# Altium schematic sheet TempMeasure.SchDoc
size A4; SheetNumber: 1; SheetTotal: 1
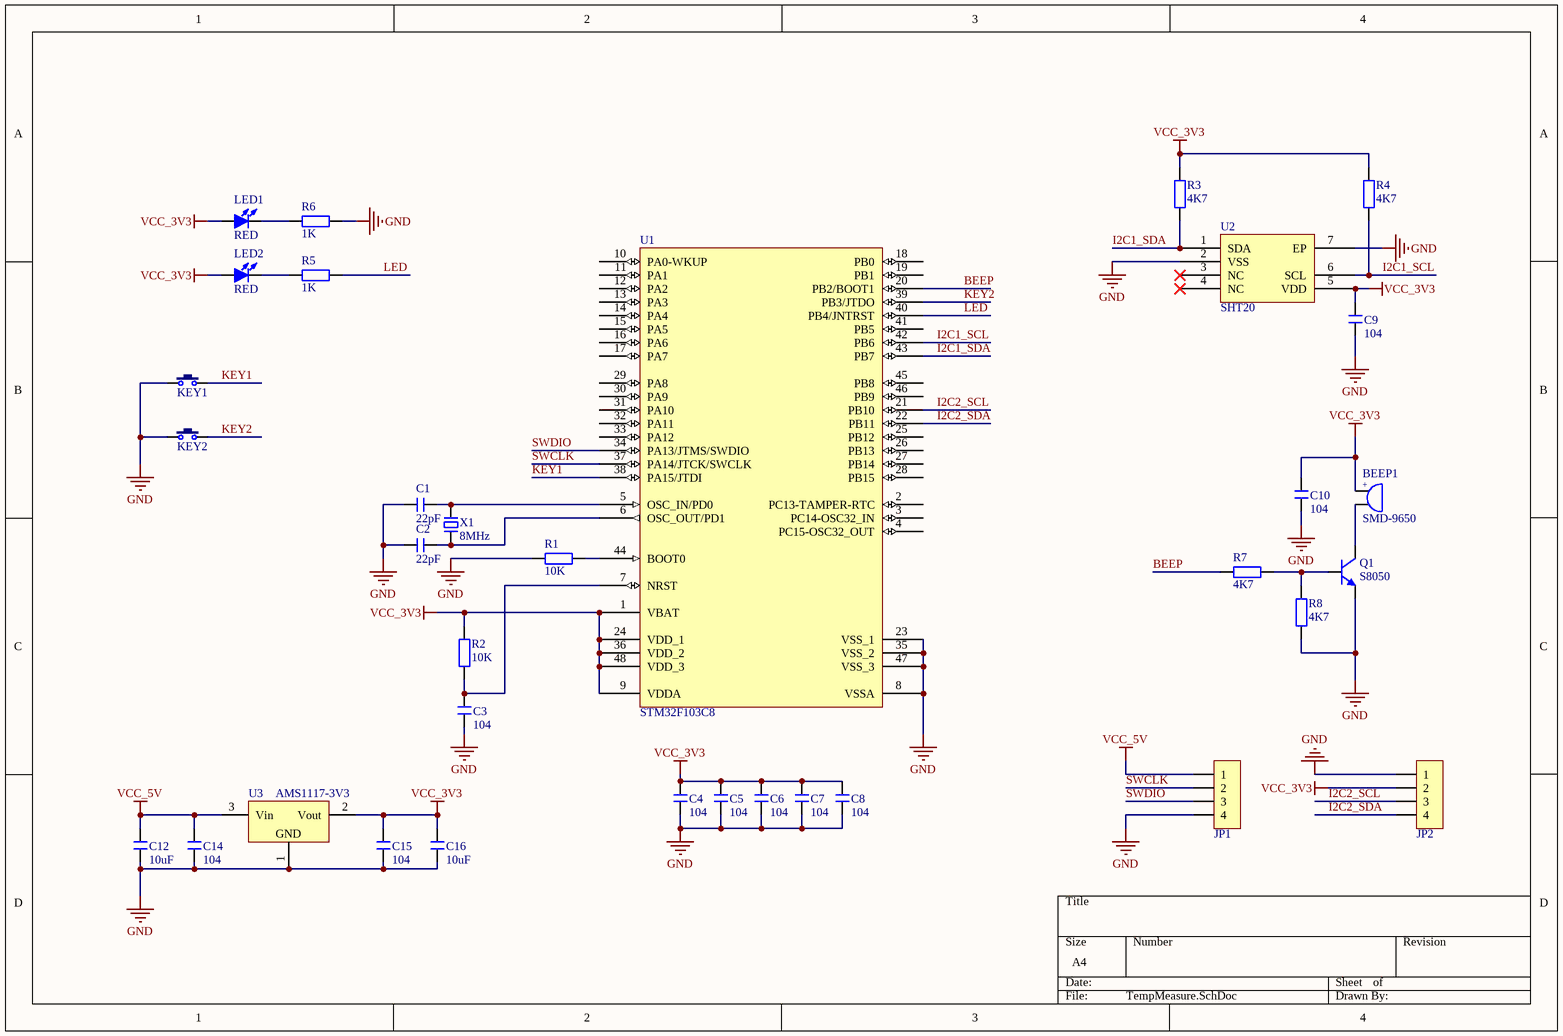
[diagram p0: TempMeasure.SchDoc]

## Parts
BEEP1  SMD-9650  [BUZ-SMD-9650]
C1  22pF  [C 0805]
C2  22pF  [C 0805]
C3  104  [C 0805]
C4  104  [C 0805]
C5  104  [C 0805]
C6  104  [C 0805]
C7  104  [C 0805]
C8  104  [C 0805]
C9  104  [C 0805]
C10  104  [C 0805]
C12  10uF  [C 0805]
C14  104  [C 0805]
C15  104  [C 0805]
C16  10uF  [C 0805]
JP1  HDR-1X4  [XH2.54-LI-4P]  (value not drawn)
JP2  HDR-1X4  [HDR2.54-M-LI-4P]  (value not drawn)
KEY1  KEY  [ButtonTACT_3x4x2_180]  (value not drawn)
KEY2  KEY  [ButtonTACT_3x4x2_180]  (value not drawn)
LED1  RED  [LED 0805R]
LED2  RED  [LED 0805G]
Q1  S8050  [SOT23-3N]
R1  10K  [R 0805]
R2  10K  [R 0805]
R3  4K7  [R 0805]
R4  4K7  [R 0805]
R5  1K  [R 0805]
R6  1K  [R 0805]
R7  4K7  [R 0805]
R8  4K7  [R 0805]
U1  STM32F103C8  [LQFP48 7X7_N]
U2  SHT20  [DFN-6]
U3  AMS1117-3V3  [SOT223_L]
X1  8MHz  [XTAL-49S SMD]

## Nets
GND: C1.1 C2.1 C3.1 C4.1 C5.1 C6.1 C7.1 C8.1 C9.1 C10.1 C12.1 C14.2 C15.1 C16.1 JP1.4 JP2.1 KEY1.1 KEY2.1 Q1.2(E) R1.1 R6.2 R8.1 U1.8(VSSA) U1.23(VSS_1) U1.35(VSS_2) U1.47(VSS_3) U2.2(VSS) U2.7(EP) U3.1(GND)
VCC_3V3: BEEP1.1 C4.2 C5.2 C6.2 C7.2 C8.2 C9.2 C10.2 C15.2 C16.2 JP2.2 LED1.1(A) LED2.1(A) R2.2 R3.2 R4.2 U1.1(VBAT) U1.9(VDDA) U1.24(VDD_1) U1.36(VDD_2) U1.48(VDD_3) U2.5(VDD) U3.2(Vout)
VCC_5V: C12.2 C14.1 JP1.1 U3.3(Vin)
BEEP: R7.1 U1.20(PB2/BOOT1)
I2C1_SCL: R4.1 U1.42(PB6) U2.6(SCL)
I2C1_SDA: R3.1 U1.43(PB7) U2.1(SDA)
I2C2_SCL: JP2.3 U1.21(PB10)
I2C2_SDA: JP2.4 U1.22(PB11)
KEY1: KEY1.2 U1.38(PA15/JTDI)
KEY2: KEY2.2 U1.39(PB3/JTDO)
LED: R5.2 U1.40(PB4/JNTRST)
SWCLK: JP1.2 U1.37(PA14/JTCK/SWCLK)
SWDIO: JP1.3 U1.34(PA13/JTMS/SWDIO)
NetBEEP1_2: BEEP1.2 Q1.3(C)
NetC1_2: C1.2 U1.5(OSC_IN/PD0) X1.2
NetC2_2: C2.2 U1.6(OSC_OUT/PD1) X1.1
NetC3_2: C3.2 R2.1 U1.7(NRST)
NetLED1_2: LED1.2(K) R6.1
NetLED2_2: LED2.2(K) R5.1
NetQ1_1: Q1.1(B) R7.2 R8.2
NetR1_2: R1.2 U1.44(BOOT0)

Not connected (* = marked no-connect by the designer): U1 2(PC13-TAMPER-RTC) 3(PC14-OSC32_IN) 4(PC15-OSC32_OUT) 10(PA0-WKUP) 11(PA1) 12(PA2) 13(PA3) 14(PA4) 15(PA5) 16(PA6) 17(PA7) 18(PB0) 19(PB1) 25(PB12) 26(PB13) 27(PB14) 28(PB15) 29(PA8) 30(PA9) 31(PA10) 32(PA11) 33(PA12) 41(PB5) 45(PB8) 46(PB9); U2 3(NC)* 4(NC)*

## Notes on the sheet
- (in symbol BEEP) +

## Library data of the parts
BEEP1 = BEEP: 蜂鸣器; 版权归属: 源创客; BOM名称: 蜂鸣器; 学习资源: www.ooocke.com
C1-C10 C12 C14-C16 = C: 无极性贴片电容; 版权归属: 源创客; BOM名称: 无极性贴片电容; 学习资源: www.ooocke.com
JP1 JP2 = Header 4: 4P接插件; 版权归属: 源创客; BOM名称: 4P接插件; 学习资源: www.ooocke.com
KEY1 KEY2 = KEY: 按键; BOM名称: 3x6轻触开关; 版权归属: 源创客; 学习资源: www.ooocke.com
LED1 LED2 = LED-SMD: 贴片LED; 版权归属: 源创客; BOM名称: 贴片LED; 学习资源: www.ooocke.com
Q1 = 8050-SMD: 高频放大-NPN型; 版权归属: 源创客; 属性: 40V 1.5A 1W 100MHZ; BOM名称: 高频放大-NPN型; 学习资源: www.ooocke.com
R1-R8 = R: 贴片电阻; 版权归属: 源创客; BOM名称: 贴片电阻; 学习资源: www.ooocke.com
U1 = STM32F103C8: Flaah:64/RAM:20/IO:36; BOM名称: 32位STM单片机; 版权归属: 源创客; 学习资源: www.ooocke.com
U3 = AMS1117: 三端稳压芯片; BOM名称: 稳压芯片; 版权归属: 源创客; 学习资源: www.ooocke.com
X1 = XTAL-2P: 2脚无源晶振; BOM名称: 2脚晶振; 版权归属: 源创客; 学习资源: www.ooocke.com